# Altium schematic sheet OLED_PCB_Rev1.SchDoc
size A2; CompanyName: OMNITECH ELECTRONICS INCORPORATED; Organization: Omnitech Electronics Inc.; Address1: 1-10 Akerley Blvd, Dartmouth, Nova Scotia, Canada B3B 1J4; Address2: (902) 468-5911, FAX (902) 468-5912; Address3: www.omnitechelectronics.ca; SheetTotal: 5; PageSetup: Record=PageOptions|CenterHorizontal=True|CenterVertical=True|PrintScale=0.67|XCorrection=1.00|YCorrection=1.00|PrintKind=1|BorderSize=5000000|LeftOffset=0|BottomOffset=0|Orientation=2|PaperLength=1000|PaperWidth=1000|Scale=100|PaperSource=15|PrintQuality=600|MediaType=1|DitherType=10|PaperKind=11x17|PrintScaleMode=1
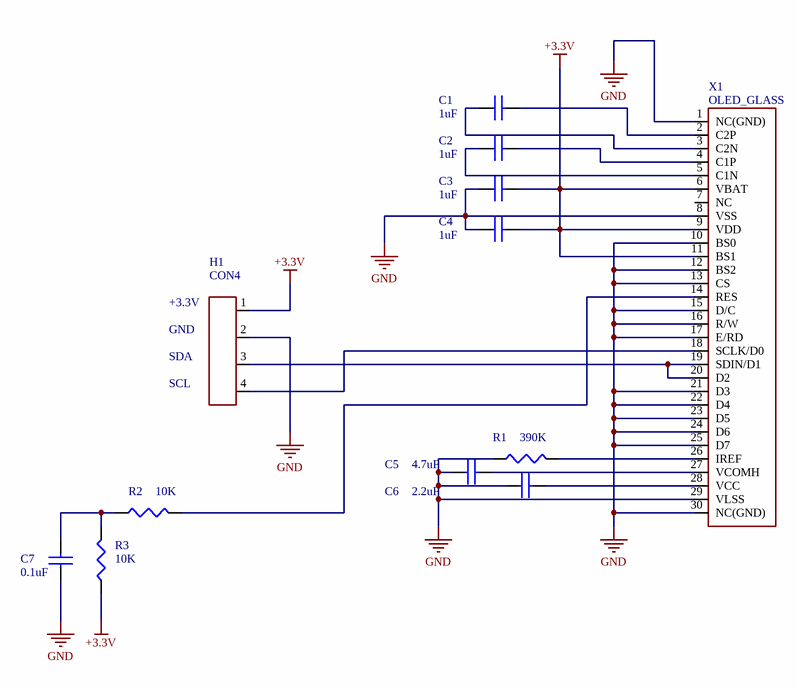
[diagram p0: OLED_PCB_Rev1.SchDoc]

## Parts
C1  1uF  [CAPC1608X90N]
C2  1uF  [CAPC1608X90N]
C3  1uF  [CAPC1608X90N]
C4  1uF  [CAPC1608X90N]
C5  4.7uF  [CAPC1608X90N]
C6  2.2uF  [CAPC1608X90N]
C7  0.1uF  [CAPC1608X90N]
H1  CON4  [HDR1X4-Empty]
R1  390K  [RESC1608X55N]
R2  10K  [RESC1608X55N]
R3  10K  [RESC1608X55N]
X1  OLED_GLASS  [OLED_GLASS]

## Nets
+3.3V: C3.2 C4.2 H1.1 R3.1 X1.6(VBAT) X1.9(VDD) X1.11(BS1)
GND: C3.1 C4.1 C5.1 C6.1 C7.1 H1.2 R1.1 X1.1(NC(GND)) X1.8(VSS) X1.10(BS0) X1.12(BS2) X1.13(CS) X1.15(D/C) X1.16(R/W) X1.17(E/RD) X1.21(D3) X1.22(D4) X1.23(D5) X1.24(D6) X1.25(D7) X1.29(VLSS) X1.30(NC(GND))
NetC1_1: C1.1 X1.3(C2N)
NetC1_2: C1.2 X1.2(C2P)
NetC2_1: C2.1 X1.5(C1N)
NetC2_2: C2.2 X1.4(C1P)
NetC5_2: C5.2 X1.27(VCOMH)
NetC6_2: C6.2 X1.28(VCC)
NetC7_2: C7.2 R2.1 R3.2
NetH1_3: H1.3 X1.19(SDIN/D1) X1.20(D2)
NetH1_4: H1.4 X1.18(SCLK/D0)
NetR1_2: R1.2 X1.26(IREF)
NetR2_2: R2.2 X1.14(RES)

Not connected (* = marked no-connect by the designer): X1 7(NC)

## Notes on the sheet
- (near H1) +3.3V
- (near H1) SDA
- (near H1) SCL
- (near H1) GND

## Library data of the parts
C1-C7 = CAP_0603: CAP 0603
  C1-C4: Value: 1uF
  C5: Value: 4.7uF
  C6: Value: 2.2uF
  C7: Value: 0.1uF
H1 = CON4: CONN HEADER 4POS .100" PADS; PartNumber: PADS
R1-R3 = RES_0603: RES 0603
  R1: Value: 390K
  R2 R3: Value: 10K
X1 = OLED_GLASS: PartNumber: N/A; Manufacturer: N/A